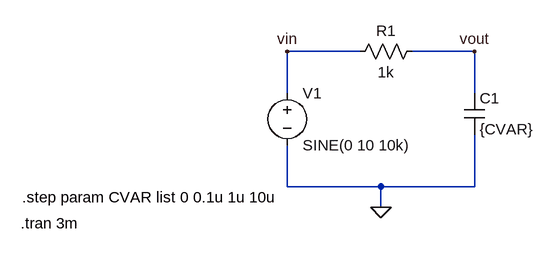
[diagram p0: schematic 1_Zadatak_lab2.asc]
1_Zadatak_lab2.asc, the LTspice schematic file:
Version 4
SHEET 1 880 680
WIRE 128 96 16 96
WIRE 304 96 208 96
WIRE 16 160 16 96
WIRE 304 160 304 96
WIRE 16 304 16 240
WIRE 160 304 16 304
WIRE 304 304 304 224
WIRE 304 304 160 304
WIRE 160 336 160 304
FLAG 160 336 0
FLAG 16 96 vin
FLAG 304 96 vout
SYMBOL res 224 80 R90
WINDOW 0 0 56 VBottom 2
WINDOW 3 32 56 VTop 2
SYMATTR InstName R1
SYMATTR Value 1k
SYMBOL cap 288 160 R0
SYMATTR InstName C1
SYMATTR Value {CVAR}
SYMBOL voltage 16 144 R0
WINDOW 123 0 0 Left 0
WINDOW 39 0 0 Left 0
SYMATTR InstName V1
SYMATTR Value SINE(0 10 10k)
TEXT -392 320 Left 2 !.step param CVAR list 0 0.1u 1u 10u
TEXT -394 360 Left 2 !.tran 3m

The netlist it stands for:
* 1_Zadatak_lab2.asc
R1 vout vin 1k
C1 vout 0 {CVAR}
V1 vin 0 SINE(0 10 10k)
.step param CVAR list 0 0.1u 1u 10u
.tran 3m
.backanno
.end